# EAGLE design 8chADC_V2 (EAGLE 7.6.0)
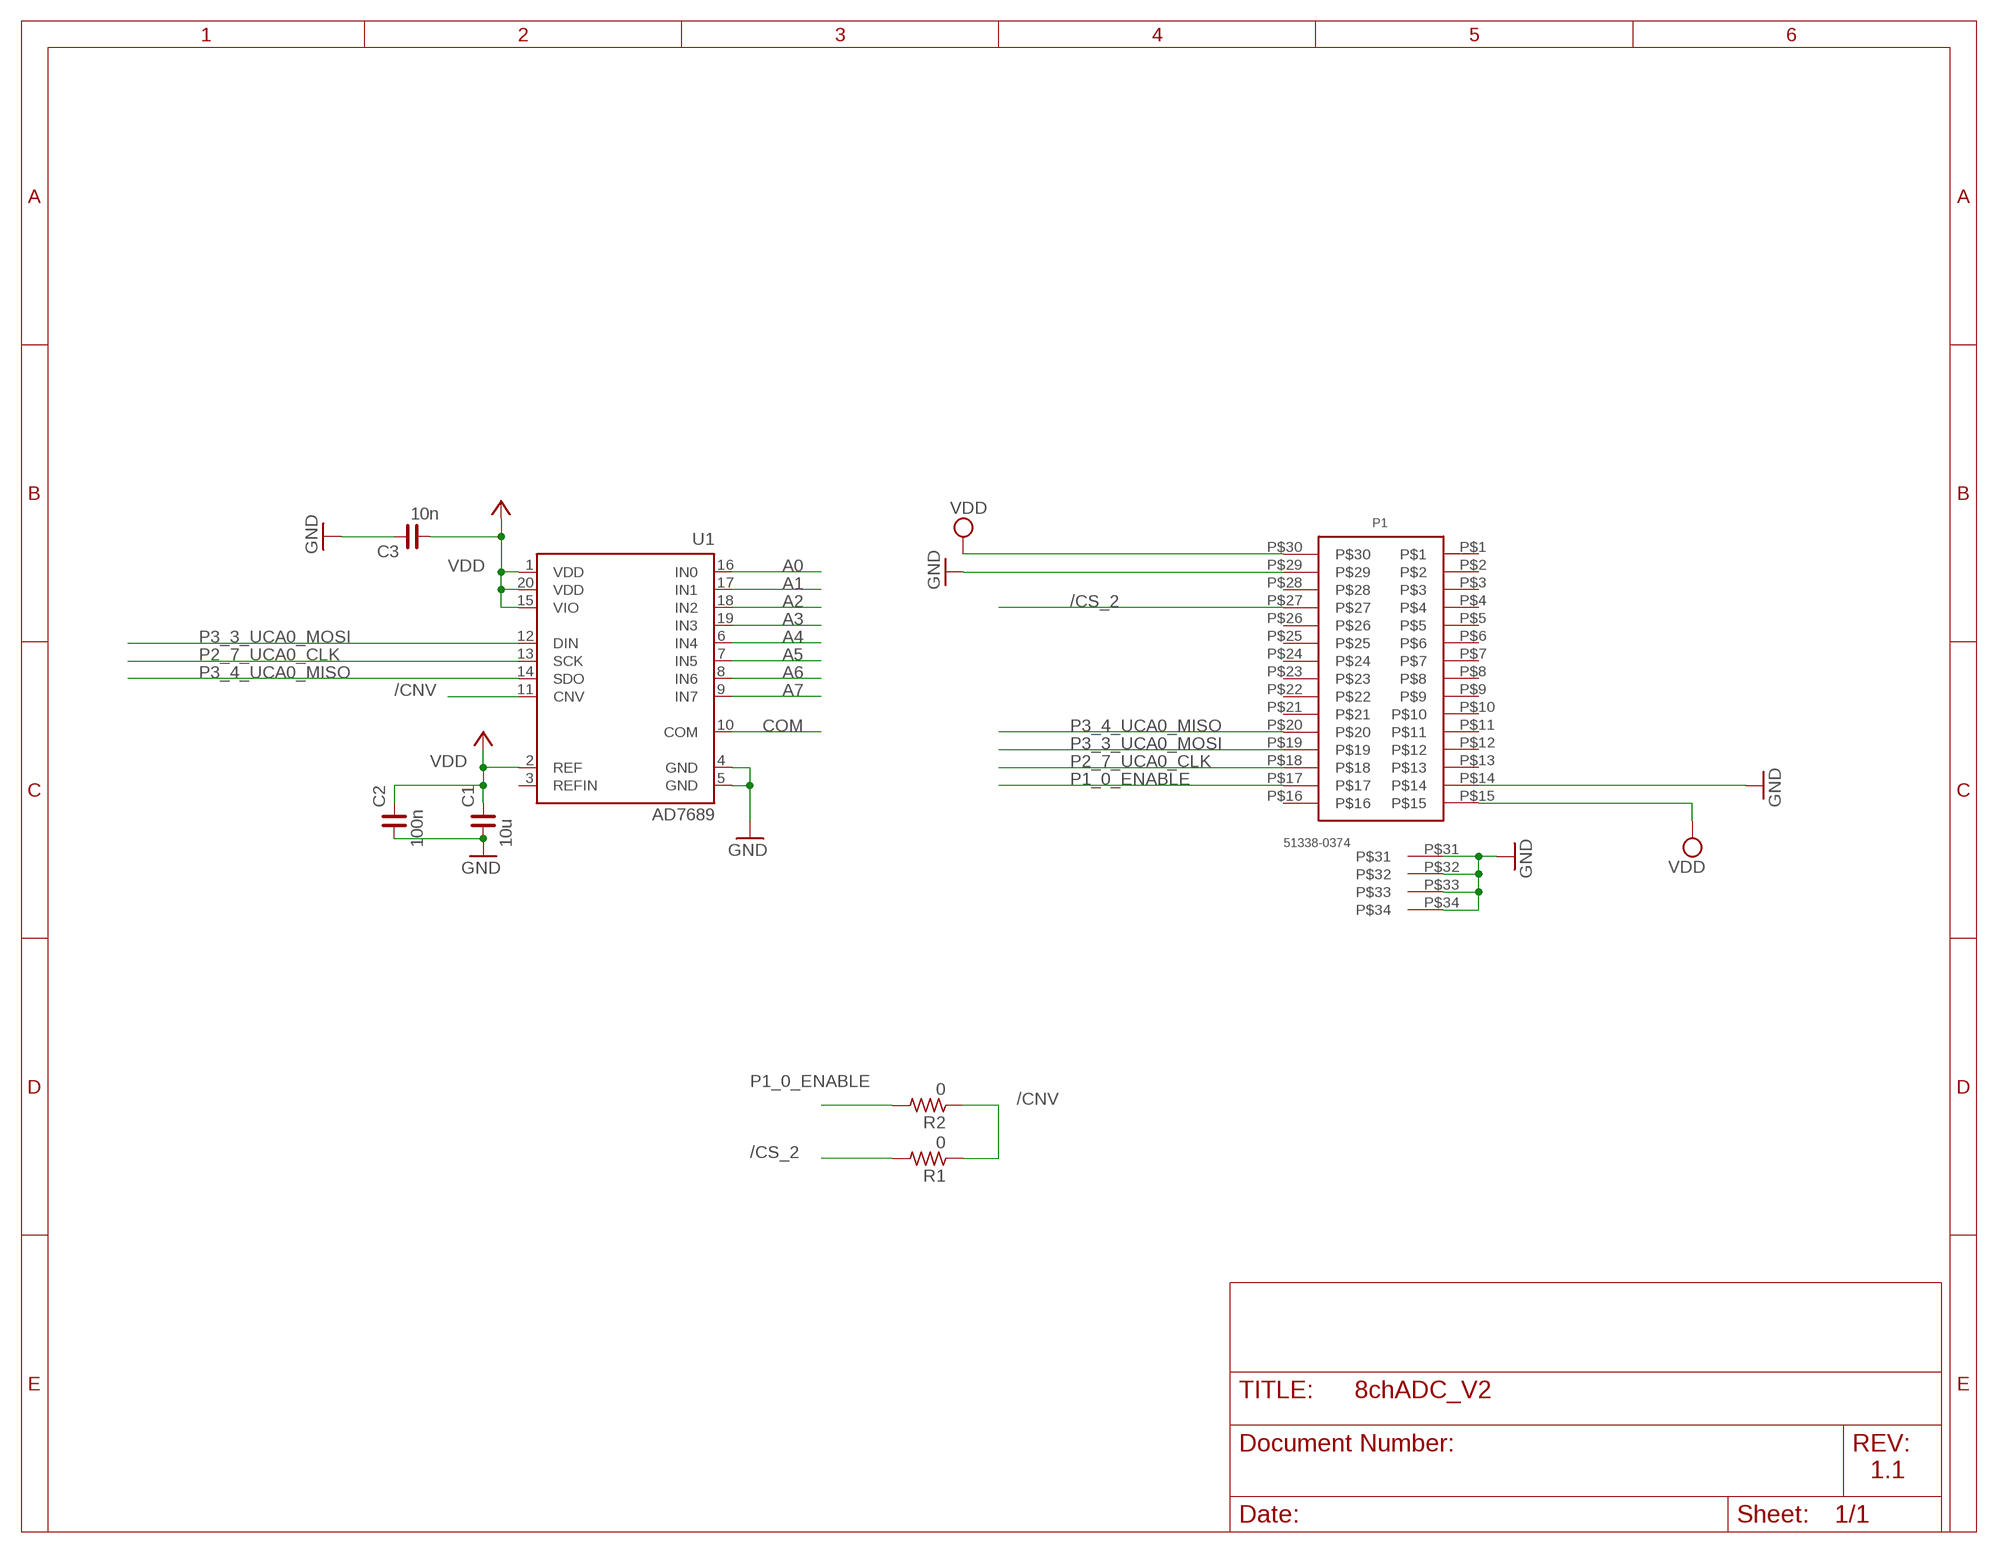
[diagram p0: schematic, sheet 1]

## Parts
C1  10u  C_0402  [C0402]
C2  100n  C_0402  [C0402]
C3  10n  C_0402  [C0402]
P1  51338-0374  51338-0374_RECEPTACLE  [51338-0374_RECEPTACLE]
R1  0  R_0402  [R0402]
R2  0  R_0402  [R0402]
U1  AD7689  [LFCSP20]

## Nets
/CNV: R1.1 R2.1 U1.11(CNV)
/CS_2: P1.P$27 R1.2
A0: U1.16(IN0)
A1: U1.17(IN1)
A2: U1.18(IN2)
A3: U1.19(IN3)
A4: U1.6(IN4)
A5: U1.7(IN5)
A6: U1.8(IN6)
A7: U1.9(IN7)
COM: U1.10(COM)
GND: C1.1 C2.1 C3.2 P1.P$14 P1.P$29 P1.P$31 P1.P$32 P1.P$33 P1.P$34 U1.4(GND) U1.5(GND)
P1_0_ENABLE: P1.P$17 R2.2
P2_7_UCA0_CLK: P1.P$18 U1.13(SCK)
P3_3_UCA0_MOSI: P1.P$19 U1.12(DIN)
P3_4_UCA0_MISO: P1.P$20 U1.14(SDO)
VDD: C1.2 C2.2 C3.1 P1.P$15 P1.P$30 U1.1(VDD) U1.2(REF) U1.15(VIO) U1.20(VDD) ; supply symbol labelled +3V3
Unconnected: P1.P$1 P1.P$2 P1.P$3 P1.P$4 P1.P$5 P1.P$6 P1.P$7 P1.P$8 P1.P$9 P1.P$10 P1.P$11 P1.P$12 P1.P$13 P1.P$16 P1.P$21 P1.P$22 P1.P$23 P1.P$24 P1.P$25 P1.P$26 P1.P$28 U1.3(REFIN)

## Notes on the sheet
- 1.1

## Library data of the parts
C1-C3 = rc-master-smd:C_: NON-POLARIZED CAP
P1 = Molex_SlimStack:51338-0374_RECEPTACLE
R1 R2 = rc-master-smd:R_: RESISTOR
U1 = analog-devices:AD7689

## Board
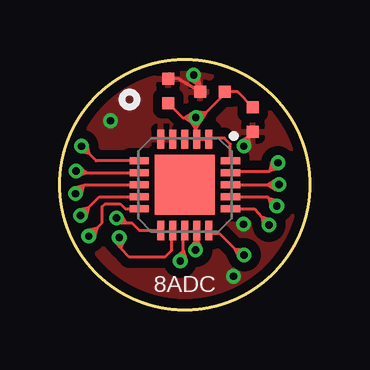
[diagram p1: board, top side]
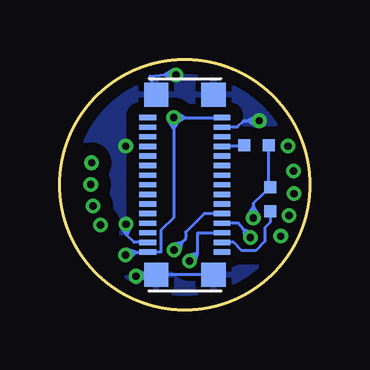
[diagram p2: board, bottom side, seen from below]

Size 10.4 x 10.4 mm. Coordinates in mm from the lower left corner, seen from the top.
Outline: circle at 5.2,5.2 radius 5.2
Copper layers (1*16): Top 0.035mm / dielectric 1.5mm / Bottom 0.035mm
Design rules "DIRTY_PCB *": minimum track width 5mil, minimum drill 12mil, track to track 5mil, track to pad 5mil, pad to pad 5mil, via to via 5mil, smd to smd 0mil, copper to edge 10mil, drill to drill 10mil, minimum pad ring 10mil, minimum via ring 6mil, stop-mask expansion 0mil, vias tented up to drill 25mil, thermal gap 10mil

### Footprints (pad centres in the part's own frame; a part is rotated, then mirrored left to right if it is on the bottom)
C0402 = smd 0.5 x 0.5: 1 -0.508,0; 2 0.508,0
51338-0374_RECEPTACLE = smd 0.7 x 0.22: P$1 -1.55,2.8; P$2 -1.55,2.4; P$3 -1.55,2; P$4 -1.55,1.6; P$5 -1.55,1.2; P$6 -1.55,0.8; P$7 -1.55,0.4; P$8 -1.55,0; P$9 -1.55,-0.4; P$10 -1.55,-0.8; P$11 -1.55,-1.2; P$12 -1.55,-1.6; P$13 -1.55,-2; P$14 -1.55,-2.4; P$15 -1.55,-2.8; P$16 1.55,-2.8; P$17 1.55,-2.4; P$18 1.55,-2; P$19 1.55,-1.6; P$20 1.55,-1.2; P$21 1.55,-0.8; P$22 1.55,-0.4; P$23 1.55,0; P$24 1.55,0.4; P$25 1.55,0.8; P$26 1.55,1.2; P$27 1.55,1.6; P$28 1.55,2; P$29 1.55,2.4; P$30 1.55,2.8 | smd 1.008 x 1: P$31 1.196,3.75; P$32 -1.196,3.75; P$33 -1.196,-3.75; P$34 1.196,-3.75
R0402 = smd 0.5 x 0.5: 1 -0.508,0; 2 0.508,0
LFCSP20 = smd 0.8 x 0.3: 1 -1.9,1; 2 -1.9,0.5; 3 -1.9,0; 4 -1.9,-0.5; 5 -1.9,-1; 11 1.9,-1; 12 1.9,-0.5; 13 1.9,0; 14 1.9,0.5; 15 1.9,1 | smd 0.3 x 0.8: 6 -1,-1.9; 7 -0.5,-1.9; 8 0,-1.9; 9 0.5,-1.9; 10 1,-1.9; 16 1,1.9; 17 0.5,1.9; 18 0,1.9; 19 -0.5,1.9; 20 -1,1.9 | smd 2.5 x 2.5: 21 0,0

### Placement (x,y rotation side)
C1  6.35,9.07 0 top
C2  4.51,9.11 270 top
C3  8.04,7.92 270 top
P1  5.2,5.2 0 bottom
R1  2.22,6.84 180 bottom
R2  1.65,4.6 270 bottom
U1  5.2,5.2 270 top

### Tracks (layer width: path | path; a pad name or v marks a point on that pad's centre or on a via)
/CNV  (via drill 0.3)
  Top 0.127: U1.11 3.31,3.3 3.01,3.6 2.75,3.6 | 2.75,3.6 2.56,3.6 v2.35,3.82 | 2.75,3.6 2.56,3.94 v2.35,3.82 | 2.75,3.6 2.36,3.58 v2.35,3.82
  Bottom 0.127: 1.89,6.76 R1.1 1.71,5.15 R2.1 2.35,4.43 2.35,4.28 | 2.35,4.28 v2.35,3.82 | 2.35,4.28 2.15,3.95 v2.35,3.82 | 2.35,4.28 2.55,3.95 v2.35,3.82
/CS_2
  Bottom 0.127: R1.2 2.87,6.8 P1.P$27
A0  (via drill 0.3)
  Top 0.127: U1.16 8.11,4.2 8.41,3.86 | 8.41,3.86 v8.71,3.52 | 8.41,3.86 8.47,3.48 v8.71,3.52 | 8.41,3.86 8.78,3.75 v8.71,3.52
A1  (via drill 0.3)
  Top 0.127: U1.17 8.65,4.7 8.71,4.64 | 8.71,4.64 v9.03,4.32 | 8.71,4.64 8.79,4.26 v9.03,4.32 | 8.71,4.64 9.09,4.55 v9.03,4.32
A2  (via drill 0.3)
  Top 0.127: U1.18 8.66,5.2 | 8.66,5.2 v9.11,5.2 v9.12,5.21 | 8.66,5.2 9,5 v9.12,5.21 | 8.66,5.2 8.99,5.41 v9.12,5.21
A3  (via drill 0.3)
  Top 0.127: U1.19 7.16,5.76 8.72,5.76 8.76,5.8 | 8.76,5.8 v9.08,6.12 | 8.76,5.8 9.13,5.88 v9.08,6.12 | 8.76,5.8 8.85,6.17 v9.08,6.12
A4  (via drill 0.3)
  Top 0.127: U1.6 1.51,6.2 1.22,6.49 | 1.22,6.49 v0.9,6.81 | 1.22,6.49 1.14,6.87 v0.9,6.81 | 1.22,6.49 0.85,6.58 v0.9,6.81
A5  (via drill 0.3)
  Top 0.127: v0.67,5.77 0.74,5.7 1.12,5.7 | 1.12,5.7 U1.7 | 1.12,5.7 0.83,5.95 v0.67,5.77 | 1.12,5.7 0.76,5.55 v0.67,5.77
A6  (via drill 0.3)
  Top 0.127: v0.65,4.83 0.97,5.15 | 0.97,5.15 1.02,5.2 U1.8 | 0.97,5.15 0.6,5.06 v0.65,4.83 | 0.97,5.15 0.89,4.78 v0.65,4.83
A7  (via drill 0.3)
  Top 0.127: v0.86,3.92 1.18,4.24 | 1.18,4.24 1.64,4.7 U1.9 | 1.18,4.24 0.81,4.16 v0.86,3.92 | 1.18,4.24 1.1,3.87 v0.86,3.92
COM  (via drill 0.3)
  Top 0.127: v1.2,3.06 1.52,3.38 | 1.52,3.38 1.76,3.62 1.76,4.29 1.88,4.41 2.51,4.41 2.72,4.2 U1.10 | 1.52,3.38 1.15,3.29 v1.2,3.06 | 1.52,3.38 1.44,3 v1.2,3.06
GND  (via drill 0.3)
  Top 0.127: C1.1 4.93,9.62 C2.1 | 5.84,8.86 C1.1 | v5.57,9.78 5.87,9.27 | 5.87,9.27 5.87,9.07 C1.1 | C3.2 7.85,7.22 | 7.85,7.22 7.66,7.03 v7.66,6.81 | 5.87,9.27 5.78,9.65 v5.57,9.78 | 5.87,9.27 5.37,9.65 v5.57,9.78 | 7.85,7.22 7.53,7.01 v7.66,6.81 | 7.85,7.22 7.9,6.84 v7.66,6.81
  Bottom 0.127: P1.P$32 6.65,9.73 6.03,9.78 | 6.03,9.78 v5.57,9.78 | P1.P$34 P1.P$33 | P1.P$14 7.31,2.8 7.61,3.1 | P1.P$29 3.01,7.61 2.75,7.87 2.56,7.87 | 2.56,7.87 v2.1,7.87 | 7.61,3.1 7.65,3.14 v7.65,3.56 | P1.P$33 6.65,1.48 | P1.P$33 6.78,1.45 | 6.78,1.45 7.17,1.45 v7.23,1.39 | 6.03,9.78 5.7,9.98 v5.57,9.78 | 6.03,9.78 5.7,9.57 v5.57,9.78 | 6.78,1.45 7.08,1.2 v7.23,1.39 | 6.78,1.45 7.13,1.61 v7.23,1.39 | 7.61,3.1 7.84,3.42 v7.65,3.56 | 7.61,3.1 7.44,3.45 v7.65,3.56 | 2.56,7.87 2.23,8.07 v2.1,7.87 | 2.56,7.87 2.23,7.66 v2.1,7.87
  pour Top (isolate 0.381): 0.2,5.2 arc-90 5.2,10.2 arc-90 10.2,5.2 arc-90 5.2,0.2 arc-90
  pour Bottom (isolate 0.52): 0.2,5.2 arc-90 5.2,10.2 arc-90 10.2,5.2 arc-90 5.2,0.2 arc-90
P1_0_ENABLE
  Bottom 0.127: 1.86,4.13 R2.2 1.65,3.63 1.86,3.42 1.86,2.84 2.24,2.46 2.82,2.46 3.16,2.8 P1.P$17
P2_7_UCA0_CLK  (via drill 0.3)
  Top 0.127: U1.13 5.13,3.3 5.13,2.46 | v5.01,2.02 5.13,2.14 5.13,2.46 | 5.13,2.46 4.85,2.2 v5.01,2.02 | 5.13,2.46 5.24,2.09 v5.01,2.02
  Bottom 0.127: P1.P$18 4.68,3.2 4.68,2.35 4.69,2.34 | 4.69,2.34 v5.01,2.02 | 4.69,2.34 4.78,1.96 v5.01,2.02 | 4.69,2.34 5.07,2.25 v5.01,2.02
P3_3_UCA0_MOSI  (via drill 0.3)
  Top 0.127: 4.73,3.27 U1.12 arc90 4.66,3.26 4.66,2.48 4.37,2.19 2.89,2.19 2.53,2.55 | 2.53,2.55 2.47,2.61 v2.47,3 | 2.53,2.55 2.69,2.9 v2.47,3 | 2.53,2.55 2.29,2.85 v2.47,3
  Bottom 0.127: v2.47,3 2.76,3.35 | 2.76,3.35 2.97,3.6 P1.P$19 | 2.76,3.35 2.39,3.23 v2.47,3 | 2.76,3.35 2.71,2.97 v2.47,3
P3_4_UCA0_MISO  (via drill 0.3)
  Top 0.127: U1.14 5.7,2.93 | 5.7,2.93 5.7,2.53 v5.65,2.48 | 5.7,2.93 5.46,2.63 v5.65,2.48 | 5.7,2.93 5.87,2.58 v5.65,2.48
  Bottom 0.127: P1.P$20 4.4,4 5.17,3.23 5.17,2.96 5.33,2.8 | 5.33,2.8 v5.65,2.48 | 5.33,2.8 5.42,2.42 v5.65,2.48 | 5.33,2.8 5.71,2.71 v5.65,2.48
VDD  (via drill 0.3)
  Top 0.127: U1.20 7.1,6.9 6.85,7.15 6.25,7.15 U1.1 U1.2 | U1.2 5.66,7.1 | C2.2 5.11,8 5.2,8 | 5.2,8 v5.66,8 | C3.1 7.4,9.07 C1.2 6.86,9 6.07,8.21 | 6.07,8.21 5.86,8 v5.66,8 | U1.15 6.32,3.18 6.63,3.18 7.28,2.53 | 7.28,2.53 7.44,2.37 v7.67,2.28 | U1.2 5.66,7.14 5.66,7.54 | 5.66,7.54 v5.66,8 | 5.2,8 5.53,7.79 v5.66,8 | 5.2,8 5.53,8.21 v5.66,8 | 6.07,8.21 5.68,8.24 v5.66,8 | 6.07,8.21 5.87,7.88 v5.66,8 | 5.66,7.54 5.87,7.87 v5.66,8 | 5.66,7.54 5.46,7.87 v5.66,8 | 7.28,2.53 7.45,2.18 v7.67,2.28 | 7.28,2.53 7.67,2.52 v7.67,2.28
  Bottom 0.127: v5.66,8 5.2,8 | 5.2,8 P1.P$30 | v7.67,2.28 7.86,2.4 7.23,2.4 | 7.23,2.4 P1.P$15 6.2,2.4 U1.15 5.67,3.83 5.67,7.54 | v5.66,8 v5.67,7.99 5.67,7.54 | 5.2,8 5.53,7.79 v5.66,8 | 5.2,8 5.53,8.21 v5.66,8 | 5.67,7.54 5.87,7.88 v5.66,8 | 5.67,7.54 5.46,7.87 v5.66,8 | 7.23,2.4 7.49,2.12 v7.67,2.28 | 7.23,2.4 7.6,2.51 v7.67,2.28

### Text on the board
tPlace: 8ADC